# Altium schematic sheet Connectors.SchDoc: Connectors
size OrCAD A; DocumentNumber: LM-003; Revision: C; SheetNumber: 2; SheetTotal: 4
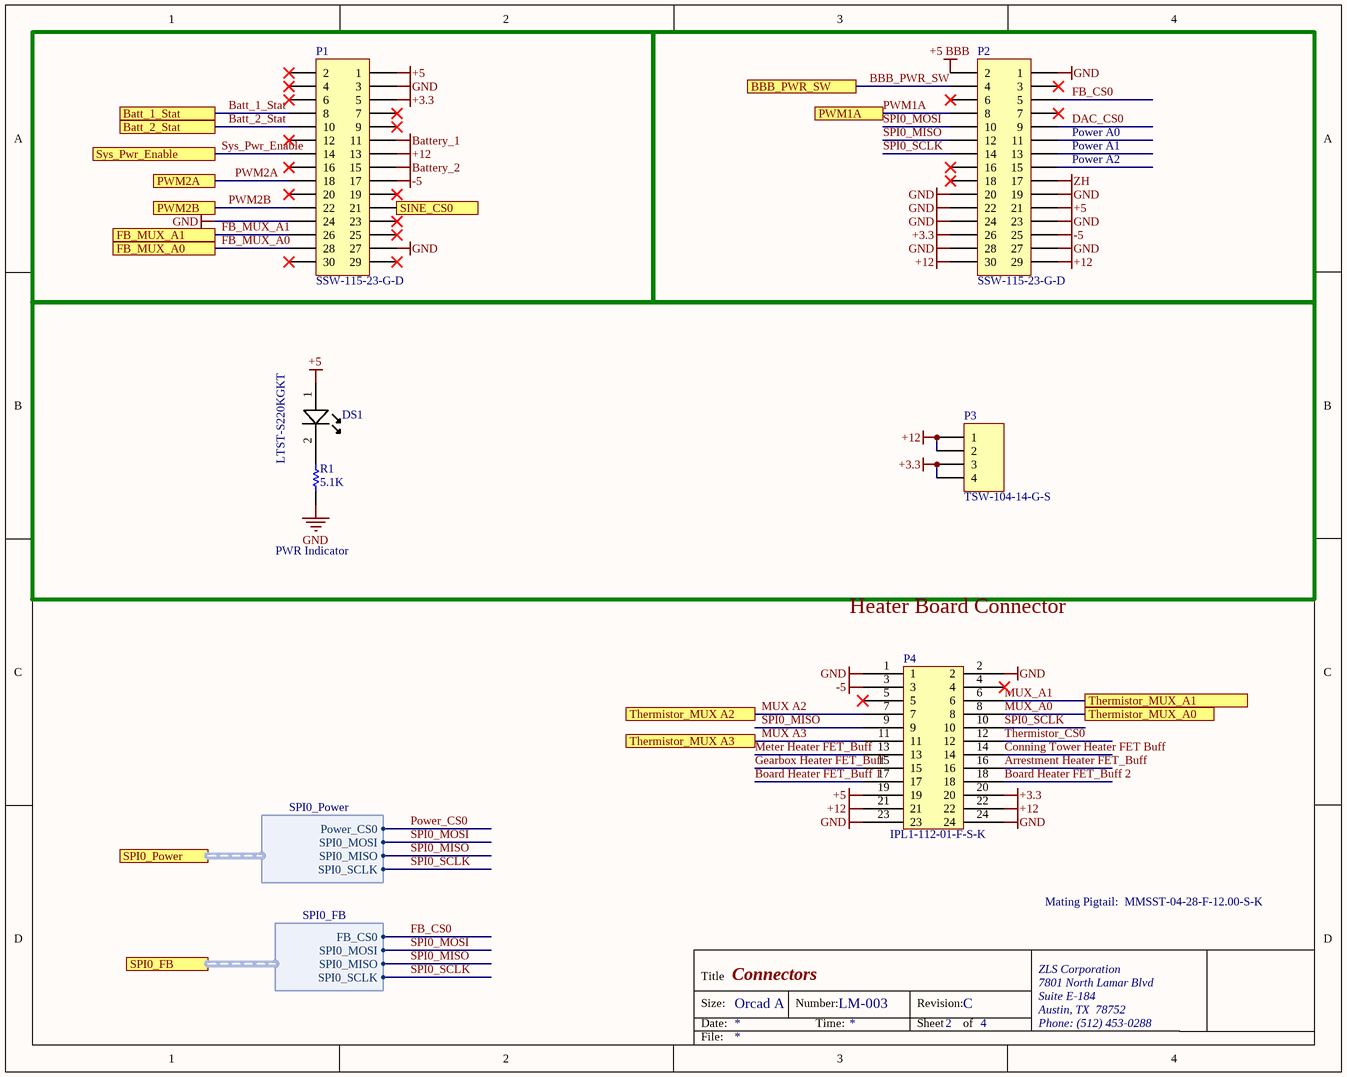
[diagram p0: Connectors.SchDoc]

## Parts
DS1  Manufacturer Part Number: LTST-S220KGKT  [0805C_L]  (hidden comment: Lite-On LTST-S220KGKT Green LED, 571 nm 2012 (0805) Side View, Rectangle Lens SMD package)
P1  SSW-115-23-G-D  [SSW-115-23-G-D]
P2  SSW-115-23-G-D  [SSW-115-23-G-D]
P3  TSW-104-14-G-S  [HDR1X4]
P4  IPL1-112-01-F-S-K  [IPL1-112-01-F-S-K]
R1  5.1K  [RESC0805(2012)_L]

## Blocks framed on the sheet
PWR Indicator: DS1 P3 R1

## Ports
Batt_1_Stat, Batt_2_Stat, BBB_PWR_SW, FB_MUX_A0, FB_MUX_A1, PWM1A, PWM2A, PWM2B, SINE_CS0, SPI0_FB (harness SPI0_FB), SPI0_Power (harness SPI0_Power), Sys_Pwr_Enable, Thermistor_MUX A2, Thermistor_MUX A3, Thermistor_MUX_A0, Thermistor_MUX_A1

## Harnesses
SPI0_FB: FB_CS0, SPI0_MOSI, SPI0_MISO, SPI0_SCLK
SPI0_Power: Power_CS0, SPI0_MOSI, SPI0_MISO, SPI0_SCLK

## Nets
+3.3: P1.5 P2.26 P3.3 P3.4 P4.20
+5: DS1.1(A) P1.1 P2.21 P4.19
+5 BBB: P2.2
+12: P1.13 P2.29 P2.30 P3.1 P3.2 P4.21 P4.22
-5: P1.17 P2.25 P4.3
Battery_1: P1.11
Battery_2: P1.15
GND: P1.3 P1.24 P1.27 P2.1 P2.19 P2.20 P2.22 P2.23 P2.24 P2.27 P2.28 P4.1 P4.2 P4.23 P4.24 R1.2
ZH: P2.17
Arrestment Heater FET_Buff: P4.16
Batt_1_Stat: P1.8 ; port Batt_1_Stat
Batt_2_Stat: P1.10 ; port Batt_2_Stat
BBB_PWR_SW: P2.4 ; port BBB_PWR_SW
Board Heater FET_Buff 1: P4.17
Board Heater FET_Buff 2: P4.18
Conning Tower Heater FET Buff: P4.14
DAC_CS0: P2.9
FB_CS0: P2.5 ; port SPI0_FB.FB_CS0
FB_MUX_A0: P1.28 ; port FB_MUX_A0
FB_MUX_A1: P1.26 ; port FB_MUX_A1
Gearbox Heater FET_Buff: P4.15
Meter Heater FET_Buff: P4.13
MUX A2: P4.7 ; port Thermistor_MUX A2
MUX A3: P4.11 ; port Thermistor_MUX A3
MUX_A0: P4.8 ; port Thermistor_MUX_A0
MUX_A1: P4.6 ; port Thermistor_MUX_A1
Power_CS0: port SPI0_Power.Power_CS0
PWM1A: P2.8 ; port PWM1A
PWM2A: P1.18 ; port PWM2A
PWM2B: P1.22 ; port PWM2B
SINE_CS0: P1.21 ; port SINE_CS0
SPI0_MISO: P2.12 P4.9 ; port SPI0_FB.SPI0_MISO, port SPI0_Power.SPI0_MISO
SPI0_MOSI: P2.10 ; port SPI0_FB.SPI0_MOSI, port SPI0_Power.SPI0_MOSI
SPI0_SCLK: P2.14 P4.10 ; port SPI0_FB.SPI0_SCLK, port SPI0_Power.SPI0_SCLK
Sys_Pwr_Enable: P1.14 ; port Sys_Pwr_Enable
Thermistor_CS0: P4.12
NetDS1_2: DS1.2(K) R1.1

Not connected (* = marked no-connect by the designer): P1 2* 4* 6* 7* 9* 12* 16* 19* 20* 23* 25* 29* 30*; P2 3* 6* 7* 11 13 15 16* 18*; P4 4* 5*

## Notes on the sheet
- (near P2) Power A0
- (near P2) Power A1
- (near P2) Power A2
- Heater Board Connector
- Mating Pigtail:  MMSST-04-28-F-12.00-S-K
- Title
- Size:
- Date:
- Orcad A
- Number:
- Time:
- Revision:
- Sheet
- of
- ZLS Corporation
- 7801 North Lamar Blvd
- Suite E-184
- Austin, TX  78752
- Phone: (512) 453-0288
- File:

## Library data of the parts
DS1 = LED A/K: Manufacturer: Vishay / Lite-On; Lens Colour: Colorless; Viewing Angle: 130°; Luminous Intensity: 35mcd; Forward Current: 20mA; Forward Voltage: 2V; Lens Style: Diffused,Colorless; Power Rating: 75mW; Dominant Wavelength: 568nm; Lens Transparency: Clear; Number of Elements: 1; Power Dissipation: 75W; Wavelength: 574nm; Supplier 1: Digi-Key; Supplier Part Number 1: 160-1468-1-ND; Stock 1: 74800; Pricing 1: 1=0.29, 10=0.212, 25=0.1564, 100=0.1117, 250=0.0759, 500=0.067, 1000=0.0525 (USD); Mount: Surface Mount; Case/Package: 0805; Number of Pins: 2; Colour: Green; Case Code (Metric): 2012; Case Code (Imperial): 0805; Min Operating Temperature: -55°C; Max Operating Temperature: 85°C; Packaging: Tape and Reel; Package Quantity: 4000; Illumination Colour: Green; Test Current: 20mA; Number of LEDs: 1; Length: 2.1mm; Height: 0.6mm; Width: 1mm; Depth: 0.6mm; Radiation Hardening: No; Lead Free: Lead Free; ComponentLink1URL: https://datasheet.ciiva.com/11775/0900766b80dc0b70-11775441.pdf; ComponentLink1Description: https://datasheet.ciiva.com/11775/0900766b80dc0b70-11775441.pdf; ComponentLink2URL: https://datasheet.ciiva.com/2110/s-110-ltst-s220kgkt-2110069.pdf; ComponentLink2Description: https://datasheet.ciiva.com/2110/s-110-ltst-s220kgkt-2110069.pdf; ComponentLink3URL: https://datasheet.ciiva.com/2110/s-110-ltst-s220kgkt-2110070.pdf; ComponentLink3Description: https://datasheet.ciiva.com/2110/s-110-ltst-s220kgkt-2110070.pdf; ComponentLink4URL: https://datasheet.ciiva.com/12400/100-ltst-s220kgkt-59602-12400886.pdf; ComponentLink4Description: https://datasheet.ciiva.com/12400/100-ltst-s220kgkt-59602-12400886.pdf; ComponentLink5URL: https://datasheet.ciiva.com/2110/s-110-ltst-s220kgkt-2110071.pdf; ComponentLink5Description: https://datasheet.ciiva.com/2110/s-110-ltst-s220kgkt-2110071.pdf; ComponentLink6URL: https://datasheet.ciiva.com/16379/ltst-s220kgkt-16379082.pdf; ComponentLink6Description: https://datasheet.ciiva.com/16379/ltst-s220kgkt-16379082.pdf
P1 P2 = Header 15X2: Header, 15-Pin, Dual row; Manufacturer: Samtec Inc.; Connector Type: Receptacle; Style: Board to Board or Cable; Number of Positions: 30; Number of Positions Loaded: All; Pitch - Mating: 0.100" (2.54mm); Contact Length - Post: 0.394" (10.00mm); Material Flammability Rating: UL94 V-0; Current Rating: 5.7A per Contact; Supplier 1: Digi-Key; Supplier Part Number 1: SSW-115-23-G-D-ND; Manufacturer Part Number: SSW-115-23-G-D; RoHS: RoHS Compliant; Category: Connectors, Interconnects; Stock 1: 0; Pricing 1: 1=5.3 (USD); Packaging: Bulk; Part Status: Active; Contact Type: Forked; Row Spacing - Mating: 0.100" (2.54mm); Mounting Type: Through Hole; Termination: Solder; Fastening Type: Push-Pull; Contact Finish - Mating: Gold; Contact Finish Thickness - Mating: 20.0µin (0.51µm); Insulation Color: Black; Insulation Height: 0.335" (8.51mm); Operating Temperature: -55°C ~ 125°C; Contact Finish - Post: Gold; Mated Stacking Heights: -; Ingress Protection: -; Features: -; Voltage Rating: -; Applications: -; Insulation Material: Liquid Crystal Polymer (LCP); Contact Shape: Square; Contact Material: Phosphor Bronze; Contact Finish Thickness - Post: 3.00µin (0.076µm)
P3 = Header 4: Header, 4-Pin; Manufacturer: Samtec Inc.; Pitch - Mating: 0.100" (2.54mm); Number of Positions: 4; Number of Positions Loaded: All; Style: Board to Board or Cable; Shrouding: Unshrouded; Contact Length - Mating: 0.320" (8.13mm); Contact Length - Post: 0.110" (2.79mm); Overall Contact Length: 0.530" (13.46mm); Material Flammability Rating: UL94 V-0; Supplier 1: Digi-Key; Supplier Part Number 1: SAM1053-04-ND; Manufacturer Part Number: TSW-104-14-G-S; RoHS: RoHS Compliant; Category: Connectors, Interconnects; Stock 1: 278; Pricing 1: 1=1.02, 10=0.915, 100=0.7537, 500=0.59578, 1000=0.51143, 5000=0.46657, 10000=0.44863 (USD); Packaging: Bulk; Part Status: Active; Connector Type: Header; Contact Type: Male Pin; Number of Rows: 1; Row Spacing - Mating: -; Mounting Type: Through Hole; Termination: Solder; Fastening Type: Push-Pull; Insulation Height: 0.100" (2.54mm); Contact Shape: Square; Contact Finish - Mating: Gold; Contact Finish Thickness - Mating: 10.0µin (0.25µm); Contact Finish - Post: Gold; Contact Material: Phosphor Bronze; Insulation Material: Polybutylene Terephthalate (PBT); Features: -; Operating Temperature: -55°C ~ 125°C; Ingress Protection: -; Insulation Color: Black; Current Rating: -; Voltage Rating: -; Mated Stacking Heights: -; Contact Finish Thickness - Post: 3.00µin (0.076µm); Applications: -; ComponentLink1URL: http://suddendocs.samtec.com/prints/tsw-xxx-xx-xxx-x-xx-xxx-mkt.pdf; ComponentLink1Description: http://suddendocs.samtec.com/prints/tsw-xxx-xx-xxx-x-xx-xxx-mkt.pdf
P4 = IPL1-112-01-F-S-K: IPL1-112-01-F-D-K; Manufacturer: Samtec Inc.; Supplier 1: Digi-Key; Supplier Part Number 1: IPL1-112-01-F-S-K-ND; Manufacturer Part Number: IPL1-112-01-F-S-K; RoHS: RoHS Compliant; Category: Connectors, Interconnects; Stock 1: 0; Pricing 1: 1=2.63 (USD); Part Status: Active
R1 = CMP-1013-00215-1: RES SMD 5.1K OHM 5% 1/8W 0805; Manufacturer: Vishay Dale; Manufacturer Part Number: CRCW08055K10JNEA; Power (Watts): 0.125W, 1/8W; Temperature Coefficient: ±200ppm/°C; Supplier 1: Digi-Key; Supplier Part Number 1: 541-5.1KACT-ND; RoHS: RoHS Compliant; Category: Resistors; Stock 1: 429; Pricing 1: 1=0.1, 10=0.044, 100=0.0178, 1000=0.00802, 2500=0.00696 (USD); Packaging: Cut Tape (CT); Part Status: Active; Tolerance: ±5%; Composition: Thick Film; Features: Automotive AEC-Q200; Operating Temperature: -55°C ~ 155°C; Package / Case: 0805 (2012 Metric); Supplier Device Package: 0805; Size / Dimension: 0.079" L x 0.049" W (2.00mm x 1.25mm); Height - Seated (Max): 0.020" (0.50mm); Failure Rate: -; ComponentLink1URL: http://www.vishay.com/docs/20035/dcrcwe3.pdf; ComponentLink1Description: http://www.vishay.com/docs/20035/dcrcwe3.pdf